# EasyEDA Pro project EasyEDAProPrj_Hackpad_numeric_keypad.epro

# Schematic Schematic1
Board Name: Board1; Create Date: 2026-03-23; Page Name: P1; Project Name: HackPad; Schematic Name: Schematic1; Update Date: 2026-03-23; Company: YuanRetro; Page Size: A4; Version: V4.0
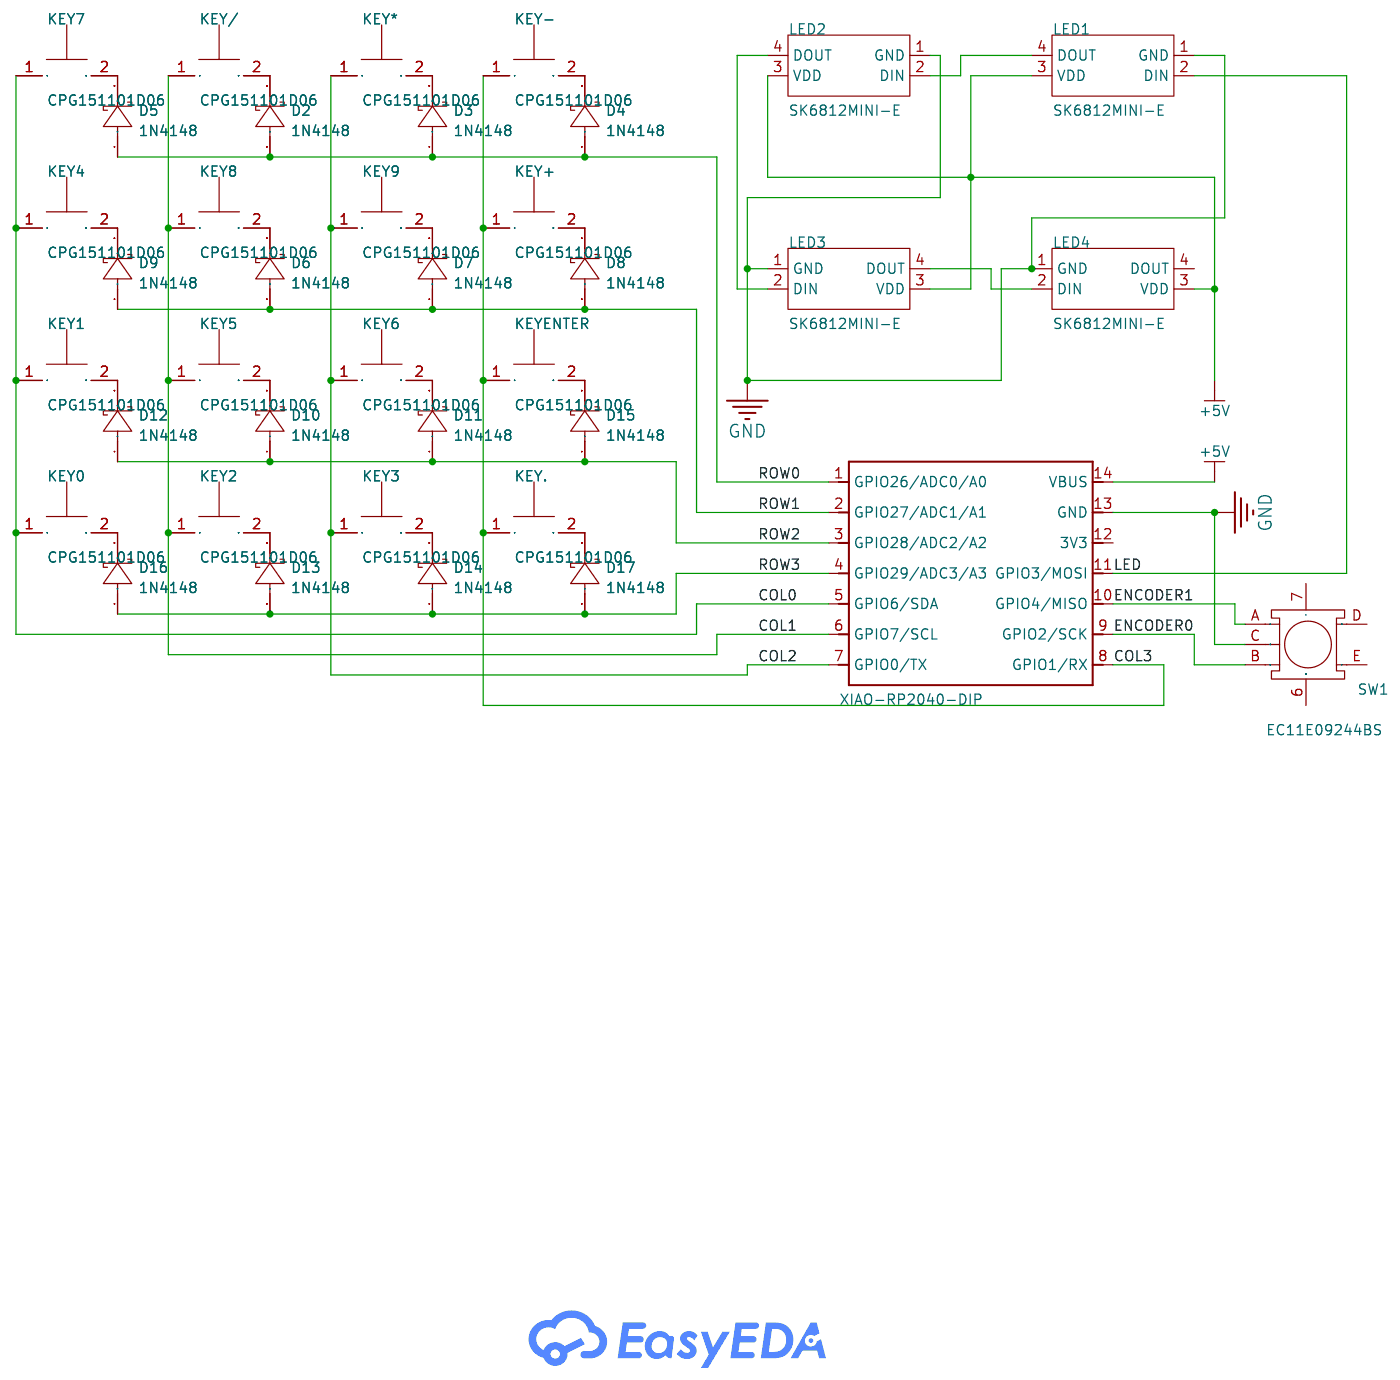
[diagram p0: schematic sheet]

## Parts
D2  1N4148  [DO-35_BD2.2-L4.0-D0.50_1N4148]
D3  1N4148  [DO-35_BD2.2-L4.0-D0.50_1N4148]
D4  1N4148  [DO-35_BD2.2-L4.0-D0.50_1N4148]
D5  1N4148  [DO-35_BD2.2-L4.0-D0.50_1N4148]
D6  1N4148  [DO-35_BD2.2-L4.0-D0.50_1N4148]
D7  1N4148  [DO-35_BD2.2-L4.0-D0.50_1N4148]
D8  1N4148  [DO-35_BD2.2-L4.0-D0.50_1N4148]
D9  1N4148  [DO-35_BD2.2-L4.0-D0.50_1N4148]
D10  1N4148  [DO-35_BD2.2-L4.0-D0.50_1N4148]
D11  1N4148  [DO-35_BD2.2-L4.0-D0.50_1N4148]
D12  1N4148  [DO-35_BD2.2-L4.0-D0.50_1N4148]
D13  1N4148  [DO-35_BD2.2-L4.0-D0.50_1N4148]
D14  1N4148  [DO-35_BD2.2-L4.0-D0.50_1N4148]
D15  1N4148  [DO-35_BD2.2-L4.0-D0.50_1N4148]
D16  1N4148  [DO-35_BD2.2-L4.0-D0.50_1N4148]
D17  1N4148  [DO-35_BD2.2-L4.0-D0.50_1N4148]
KEY0  CPG151101D06  [KEY-TH_CPG151101D06]
KEY1  CPG151101D06  [KEY-TH_CPG151101D06]
KEY2  CPG151101D06  [KEY-TH_CPG151101D06]
KEY3  CPG151101D06  [KEY-TH_CPG151101D06]
KEY4  CPG151101D06  [KEY-TH_CPG151101D06]
KEY5  CPG151101D06  [KEY-TH_CPG151101D06]
KEY6  CPG151101D06  [KEY-TH_CPG151101D06]
KEY7  CPG151101D06  [KEY-TH_CPG151101D06]
KEY8  CPG151101D06  [KEY-TH_CPG151101D06]
KEY9  CPG151101D06  [KEY-TH_CPG151101D06]
KEY*  CPG151101D06  [KEY-TH_CPG151101D06]
KEY+  CPG151101D06  [KEY-TH_CPG151101D06]
KEY-  CPG151101D06  [KEY-TH_CPG151101D06]
KEY.  CPG151101D06  [KEY-TH_CPG151101D06]
KEY/  CPG151101D06  [KEY-TH_CPG151101D06]
KEYENTER  CPG151101D06  [KEY-TH_CPG151101D06]
LED1  SK6812MINI-E  [LED-SMD_4P-L3.2-W2.8-LS5.9_SK6812MINI-E]
LED2  SK6812MINI-E  [LED-SMD_4P-L3.2-W2.8-LS5.9_SK6812MINI-E]
LED3  SK6812MINI-E  [LED-SMD_4P-L3.2-W2.8-LS5.9_SK6812MINI-E]
LED4  SK6812MINI-E  [LED-SMD_4P-L3.2-W2.8-LS5.9_SK6812MINI-E]
SW1  EC11E09244BS  [SW-TH_EC11XXXXXXXX]
U1  XIAO-RP2040-DIP  [XIAO-RP2040-DIP]

## Library data of the parts
D2-D17 = 1N4148_C18195411: Voltage - Forward(Vf@If):1V@10mA Voltage - DC Reverse(Vr):100V Current - Rectified:150mA Pd - Power Dissipation:500mW Reverse Leakage Current (Ir):5mA Reverse Recovery Time (trr):4ns Operating Junction Temperature Range:-60℃~+200℃ Operating Junction Tempe; LCSC Part Name: 100V 150mA; Supplier Part: C18195411; Manufacturer: LJ(朗捷); Supplier Footprint: DO-35; JLCPCB Part Class: Extended Part; Datasheet: https://item.szlcsc.com/datasheet/1N4148/19344798.html; Supplier: LCSC; Voltage - Forward(Vf@If): 1V@10mA; Voltage - DC Reverse(Vr): 100V; Current - Rectified: 150mA; Pd - Power Dissipation: 500mW; Reverse Leakage Current (Ir): 5mA; Reverse Recovery Time (trr): 4ns; Operating Junction Temperature Range: -60℃~+200℃; Non-Repetitive Peak Forward Surge Current: 500mA
KEY0-KEY9 KEY* KEY+ KEY- KEY. KEY/ KEYENTER = CPG151101D06: Supplier Part: C49234237; Manufacturer: HanElectricity(瀚源); Supplier Footprint: 插件; JLCPCB Part Class: Extended Part; Datasheet: https://item.szlcsc.com/datasheet/CPG151101D06/51650379.html; Supplier: LCSC
LED1-LED4 = SK6812MINI-E_C5149201: Supplier Part: C5149201; Manufacturer: 欧思科光电; Supplier Footprint: SMD; JLCPCB Part Class: Extended Part; Datasheet: https://item.szlcsc.com/datasheet/SK6812MINI-E/5773397.html; Supplier: LCSC
SW1 = EC11E09244BS: LCSC Part Name: 11型金属轴型编码器; Supplier Part: C470742; Manufacturer: ALPSALPINE(阿尔卑斯阿尔派); Supplier Footprint: 插件; JLCPCB Part Class: Extended Part; Datasheet: https://item.szlcsc.com/datasheet/EC11E09244BS/476822.html; Supplier: LCSC
U1 = XIAO-RP2040-DIP

## Nets
+5V: LED1.3(VDD) LED2.3(VDD) LED3.3(VDD) LED4.3(VDD) U1.14(VBUS)
GND: LED1.1(GND) LED2.1(GND) LED3.1(GND) LED4.1(GND) SW1.C U1.13(GND)
COL0: KEY0.1 KEY1.1 KEY4.1 KEY7.1 U1.5(GPIO6/SDA)
COL1: KEY2.1 KEY5.1 KEY8.1 KEY/.1 U1.6(GPIO7/SCL)
COL2: KEY3.1 KEY6.1 KEY9.1 KEY*.1 U1.7(GPIO0/TX)
COL3: KEY+.1 KEY-.1 KEY..1 KEYENTER.1 U1.8(GPIO1/RX)
ENCODER0: SW1.B U1.9(GPIO2/SCK)
ENCODER1: SW1.A U1.10(GPIO4/MISO)
LED: LED1.2(DIN) U1.11(GPIO3/MOSI)
ROW0: D2.1(A) D3.1(A) D4.1(A) D5.1(A) U1.1(GPIO26/ADC0/A0)
ROW1: D6.1(A) D7.1(A) D8.1(A) D9.1(A) U1.2(GPIO27/ADC1/A1)
ROW2: D10.1(A) D11.1(A) D12.1(A) D15.1(A) U1.3(GPIO28/ADC2/A2)
ROW3: D13.1(A) D14.1(A) D16.1(A) D17.1(A) U1.4(GPIO29/ADC3/A3)
$1N1250: D3.2(K) KEY*.2
$1N1291: D2.2(K) KEY/.2
$1N1373: D8.2(K) KEY+.2
$1N1414: D7.2(K) KEY9.2
$1N1455: D6.2(K) KEY8.2
$1N1496: D5.2(K) KEY7.2
$1N1537: D11.2(K) KEY6.2
$1N1578: D10.2(K) KEY5.2
$1N1619: D9.2(K) KEY4.2
$1N1660: D15.2(K) KEYENTER.2
$1N1701: D14.2(K) KEY3.2
$1N1742: D13.2(K) KEY2.2
$1N1783: D12.2(K) KEY1.2
$1N1865: D17.2(K) KEY..2
$1N1906: D16.2(K) KEY0.2
$1N10808: D4.2(K) KEY-.2
$1N11996: LED1.4(DOUT) LED2.2(DIN)
$1N12003: LED2.4(DOUT) LED3.2(DIN)
$1N12010: LED3.4(DOUT) LED4.2(DIN)

Not connected (* = marked no-connect by the designer): LED4 4(DOUT); SW1 6 7 D E; U1 12(3V3)

# Board PCB1
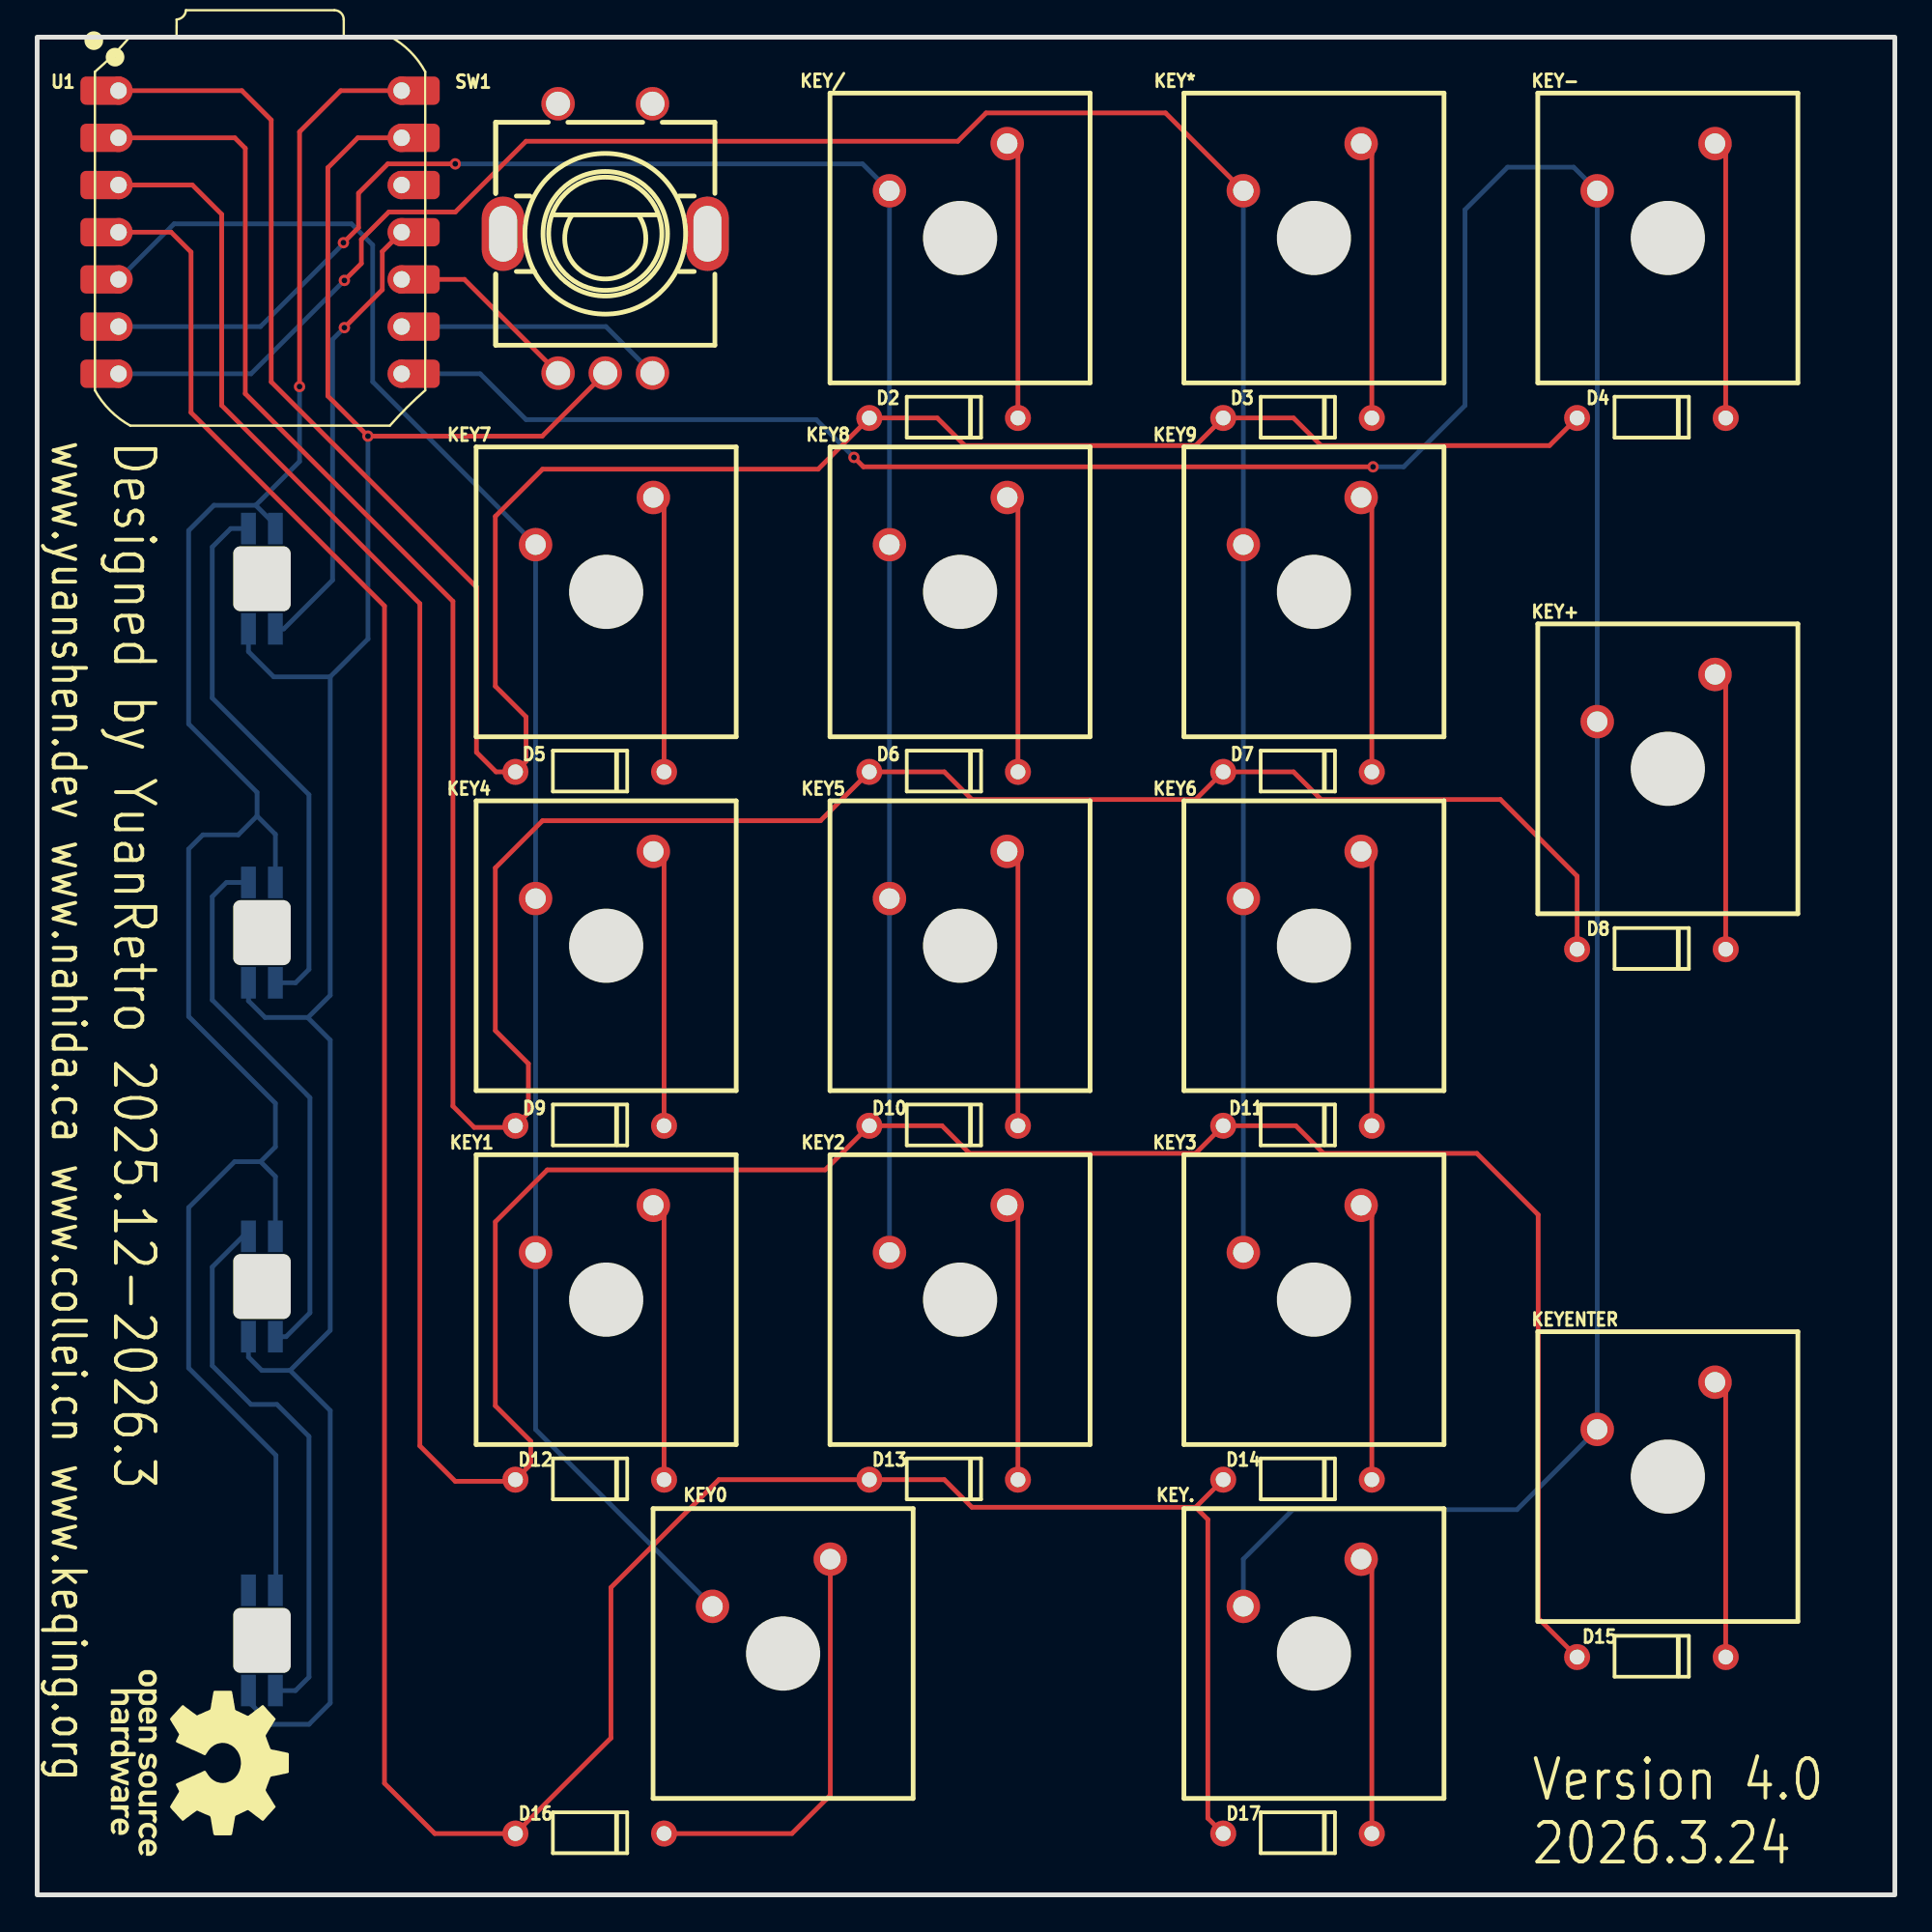
[diagram p1: board, top side]
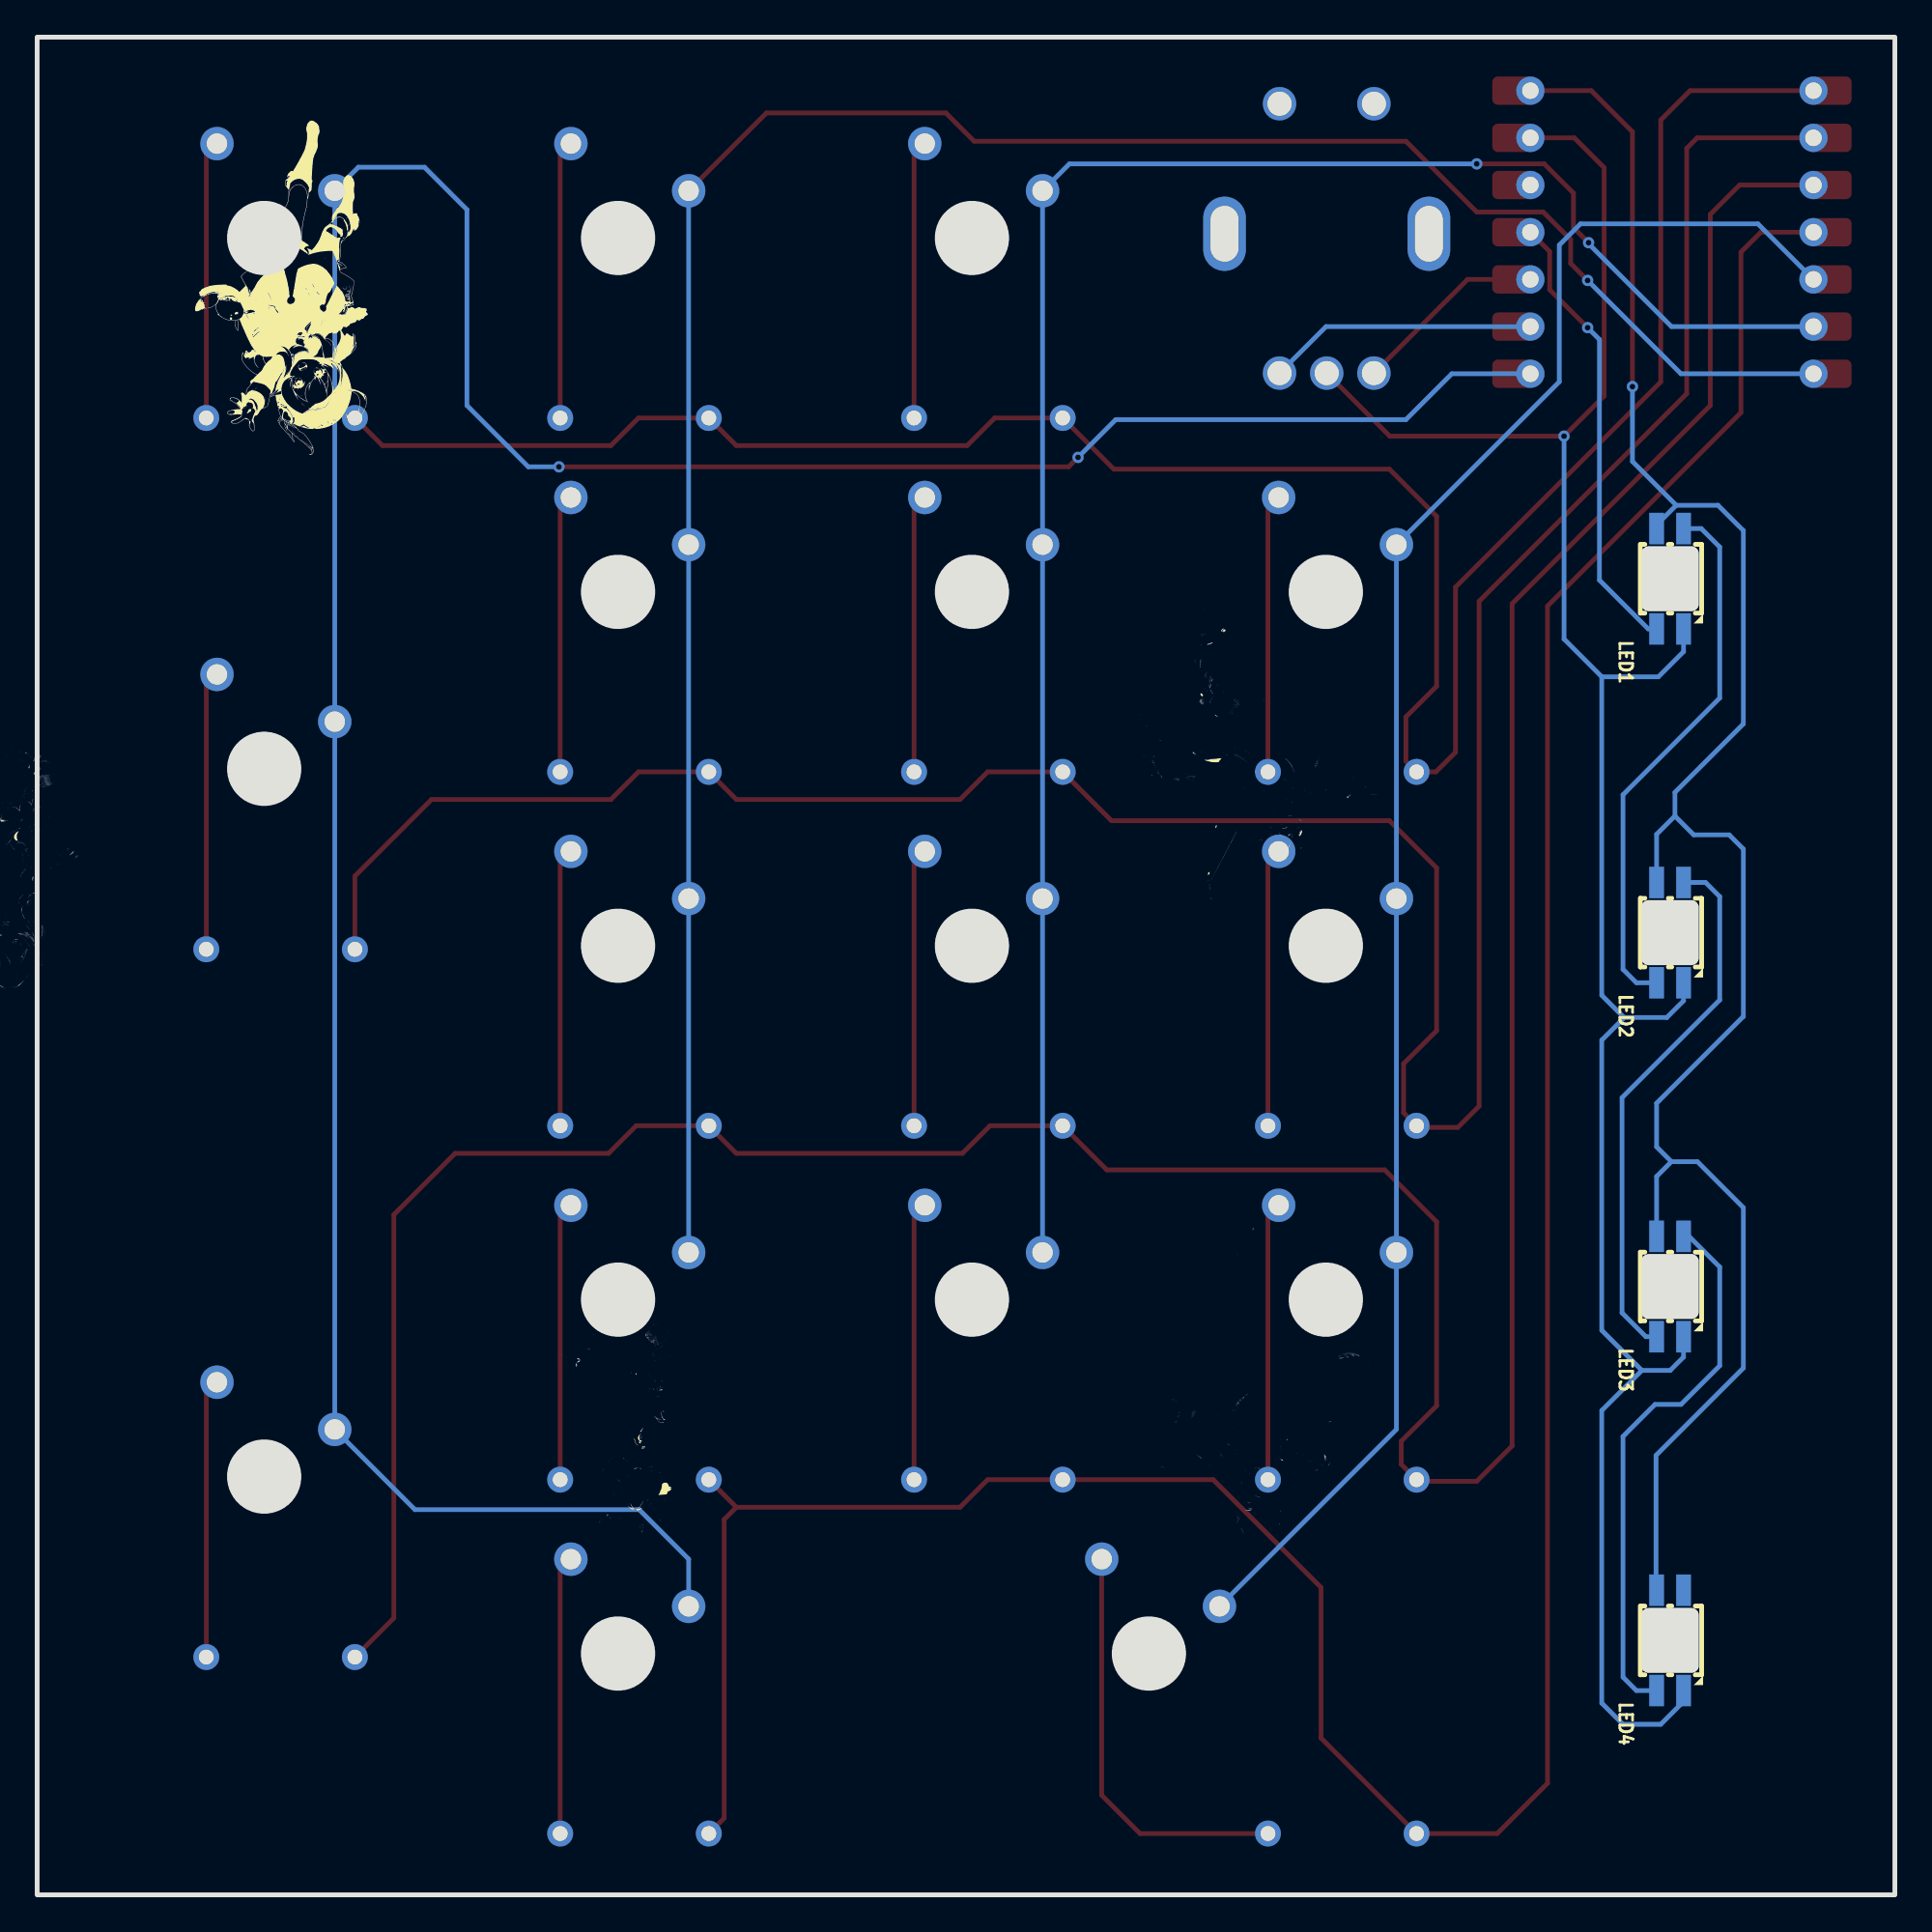
[diagram p2: board, bottom side, seen from below]

Outline 100 x 100 mm; copper layers: Top Layer, Bottom Layer. Coordinates in mm from the lower left corner of the outline.
Outline path: rectangle 0,100 100,0
Stack: Top Layer 0.035mm / Dielectric1 1.51mm FR4 er 4.5 / Bottom Layer 0.035mm

## Design rules (mm)
template: JLCPCB Capability(Two Layers Board)
spacing copperThickness1oz (default): track to track 0.102, other pairs 0.152 to 0.3
spacing copperThickness2oz: track to track 0.203, other pairs 0.152 to 0.3
track width copperThickness1oz (default): min 0.127, default 0.254, max 2.54
track width copperThickness2oz: min 0.203, default 0.254, max 2.54
differential pair differentialPair (default): width min 0.127, default 0.254, max 2.54; gap min 0.152, default 0.152
via viaSize (default): diameter min 0.5, default 0.61, max 10; hole min 0.3, default 0.305, max 6.3

## Placement (name value [footprint] x y rotation side)
D2  1N4148  [DO-35_BD2.2-L4.0-D0.50_1N4148]  48.8 79.5 0 top
D3  1N4148  [DO-35_BD2.2-L4.0-D0.50_1N4148]  67.85 79.5 0 top
D4  1N4148  [DO-35_BD2.2-L4.0-D0.50_1N4148]  86.9 79.5 0 top
D5  1N4148  [DO-35_BD2.2-L4.0-D0.50_1N4148]  29.75 60.45 0 top
D6  1N4148  [DO-35_BD2.2-L4.0-D0.50_1N4148]  48.8 60.45 0 top
D7  1N4148  [DO-35_BD2.2-L4.0-D0.50_1N4148]  67.85 60.45 0 top
D8  1N4148  [DO-35_BD2.2-L4.0-D0.50_1N4148]  86.9 50.9 0 top
D9  1N4148  [DO-35_BD2.2-L4.0-D0.50_1N4148]  29.75 41.4 0 top
D10  1N4148  [DO-35_BD2.2-L4.0-D0.50_1N4148]  48.8 41.4 0 top
D11  1N4148  [DO-35_BD2.2-L4.0-D0.50_1N4148]  67.85 41.4 0 top
D12  1N4148  [DO-35_BD2.2-L4.0-D0.50_1N4148]  29.75 22.35 0 top
D13  1N4148  [DO-35_BD2.2-L4.0-D0.50_1N4148]  48.8 22.35 0 top
D14  1N4148  [DO-35_BD2.2-L4.0-D0.50_1N4148]  67.85 22.35 0 top
D15  1N4148  [DO-35_BD2.2-L4.0-D0.50_1N4148]  86.9 12.8 0 top
D16  1N4148  [DO-35_BD2.2-L4.0-D0.50_1N4148]  29.75 3.3 0 top
D17  1N4148  [DO-35_BD2.2-L4.0-D0.50_1N4148]  67.85 3.3 0 top
KEY0  CPG151101D06  [KEY-TH_CPG151101D06]  39.53 16.8 0 top
KEY1  CPG151101D06  [KEY-TH_CPG151101D06]  30 35.85 0 top
KEY2  CPG151101D06  [KEY-TH_CPG151101D06]  49.05 35.85 0 top
KEY3  CPG151101D06  [KEY-TH_CPG151101D06]  68.1 35.85 0 top
KEY4  CPG151101D06  [KEY-TH_CPG151101D06]  30 54.9 0 top
KEY5  CPG151101D06  [KEY-TH_CPG151101D06]  49.05 54.9 0 top
KEY6  CPG151101D06  [KEY-TH_CPG151101D06]  68.1 54.9 0 top
KEY7  CPG151101D06  [KEY-TH_CPG151101D06]  30 73.95 0 top
KEY8  CPG151101D06  [KEY-TH_CPG151101D06]  49.05 73.95 0 top
KEY9  CPG151101D06  [KEY-TH_CPG151101D06]  68.1 73.95 0 top
KEY*  CPG151101D06  [KEY-TH_CPG151101D06]  68.1 93 0 top
KEY+  CPG151101D06  [KEY-TH_CPG151101D06]  87.15 64.42 0 top
KEY-  CPG151101D06  [KEY-TH_CPG151101D06]  87.15 93 0 top
KEY.  CPG151101D06  [KEY-TH_CPG151101D06]  68.1 16.8 0 top
KEY/  CPG151101D06  [KEY-TH_CPG151101D06]  49.05 93 0 top
KEYENTER  CPG151101D06  [KEY-TH_CPG151101D06]  87.15 26.33 0 top
LED1  SK6812MINI-E  [LED-SMD_4P-L3.2-W2.8-LS5.9_SK6812MINI-E]  12.1 70.85 90 bottom
LED2  SK6812MINI-E  [LED-SMD_4P-L3.2-W2.8-LS5.9_SK6812MINI-E]  12.1 51.8 90 bottom
LED3  SK6812MINI-E  [LED-SMD_4P-L3.2-W2.8-LS5.9_SK6812MINI-E]  12.1 32.75 90 bottom
LED4  SK6812MINI-E  [LED-SMD_4P-L3.2-W2.8-LS5.9_SK6812MINI-E]  12.1 13.7 90 bottom
SW1  EC11E09244BS  [SW-TH_EC11XXXXXXXX]  30.58 89.17 0 top
U1  -  [XIAO-RP2040-DIP]  12 89.5 0 top

## Footprints (pads in the part's own frame, mm; a bottom-side part is the same pattern mirrored in y, then rotated)
DO-35_BD2.2-L4.0-D0.50_1N4148
  round 1.4 hole 0.8: 1(-4,0) 2(4,0)
KEY-TH_CPG151101D06
  round 1.8 hole 1.1: 1(-3.17,-1.27) 2(3.17,1.27)
LED-SMD_4P-L3.2-W2.8-LS5.9_SK6812MINI-E
  rect 1.7x0.8 smd: 1(-2.7,-0.725) 2(-2.7,0.725) 3(2.7,0.725) 4(2.7,-0.725)
SW-TH_EC11XXXXXXXX
  oval 2.3x4 hole 1.5x3: 6(5.5,0.25) 7(-5.5,0.25)
  round 1.8 hole 1.3: A(-2.54,-7.25) B(2.54,-7.25) C(0,-7.25) D(-2.54,7.25) E(2.54,7.25)
XIAO-RP2040-DIP
  rrect 2.432x1.524 smd: 1(-8.455,7.62) 2(-8.455,5.08) 3(-8.455,2.54) 4(-8.455,0) 5(-8.455,-2.54) 6(-8.455,-5.08) 7(-8.455,-7.62) 8(8.455,-7.62) 9(8.455,-5.08) 10(8.455,-2.54) 11(8.455,0) 12(8.455,2.54) 13(8.455,5.08) 14(8.455,7.62)
  round 1.524 hole 0.889: 1(-7.62,7.62) 2(-7.62,5.08) 3(-7.62,2.54) 4(-7.62,0) 5(-7.62,-2.54) 6(-7.62,-5.08) 7(-7.62,-7.62) 8(7.62,-7.62) 9(7.62,-5.08) 10(7.62,-2.54) 11(7.62,0) 12(7.62,2.54) 13(7.62,5.08) 14(7.62,7.62)

## Nets
As in the schematic.

Pads without a net: LED4 4; SW1 6 7 D E; U1 12

## Via types
v1: diameter 0.61, hole 0.305, Top Layer to Bottom Layer, 8 vias

## Routing (per net, layer and track width the routed paths; a pad name or vN(x,y) marks a point on that pad's centre or on a via; arc(x,y) is an arc through that point)
+5V: length 109.6
  Top Layer w0.254: U1.14 16.34,97.12 14.12,94.91 v1(14.12,81.19)
  Bottom Layer w0.254: 12.03,39.47 10.63,39.47 8.16,36.99 8.16,28.36 12.86,23.66 12.86,16.43 LED4.3 ; 12.03,39.47 12.83,40.27 12.83,42.61 8.16,47.28 8.16,56.3 8.92,57.06 10.82,57.06 11.84,58.08 ; 12.03,39.47 12.83,38.67 LED3.3 ; LED1.3 12.97,73.7 ; LED2.3 12.83,57.09 11.84,58.08 ; 11.76,74.8 12.83,73.74 ; 11.76,74.8 14.12,77.16 v1(14.12,81.19) ; 11.76,74.8 9.52,74.8 8.16,73.44 8.16,63.03 11.84,59.34 11.84,58.08
GND: length 126.3
  Top Layer w0.254: U1.13 17.26,94.58 15.65,92.97 15.65,80.68 v1(17.81,78.52) 27.19,78.52 SW1.C
  Bottom Layer w0.254: 13.62,28.23 12.09,28.23 11.38,28.95 LED3.1 ; 13.62,28.23 15.78,26.07 15.78,10.32 14.63,9.18 12.6,9.18 11.46,10.32 11.46,10.91 LED4.1 ; 13.62,28.23 15.78,30.39 15.78,46.01 14.58,47.21 14.58,47.23 ; 15.78,65.57 15.78,48.42 14.58,47.23 ; 15.78,65.57 12.73,65.57 11.38,66.92 LED1.1 ; 15.78,65.57 17.81,67.6 v1(17.81,78.52) ; 14.58,47.23 12.27,47.23 11.38,48.12 LED2.1
(no net): length 0.1
  Top Layer w0.254: U1.12 19.56,91.98
COL0: length 96.3
  Bottom Layer w0.254: KEY0.1 26.83,25.06 KEY1.1 KEY4.1 KEY7.1 18.06,81.45 18.06,88.81 16.92,89.95 7.37,89.95 U1.5
COL1: length 104
  Top Layer w0.254: v1(22.51,93.18) 18.88,93.18 17.3,91.6 17.3,89.75 v1(16.49,88.94)
  Bottom Layer w0.254: v1(16.49,88.94) 16.41,88.86 16.41,88.81 12.02,84.42 U1.6 ; KEY2.1 KEY5.1 KEY8.1 KEY/.1 44.43,93.18 v1(22.51,93.18)
COL2: length 126
  Top Layer w0.254: v1(16.54,86.9) 17.45,87.82 17.45,89.11 18.93,90.59 22.51,90.59 26.32,94.4 49.56,94.4 51.08,95.92 60.74,95.92 KEY*.1
  Bottom Layer w0.254: KEY*.1 KEY9.1 KEY6.1 KEY3.1 ; v1(16.54,86.9) 11.51,81.88 U1.7
COL3: length 171
  Top Layer w0.254: v1(43.97,77.38) 44.48,76.87 v1(71.91,76.87)
  Bottom Layer w0.254: v1(71.91,76.87) 73.56,76.87 76.86,80.17 76.86,90.71 79.15,93 82.71,93 KEY-.1 KEY+.1 KEYENTER.1 79.66,20.74 67.59,20.74 64.93,18.07 KEY..1 ; U1.8 23.85,81.88 26.32,79.41 41.94,79.41 v1(43.97,77.38)
ENCODER0: length 14.5
  Bottom Layer w0.254: U1.9 30.62,84.42 SW1.B
ENCODER1: length 9.7
  Top Layer w0.254: SW1.A 23,86.96 U1.10
LED: length 24.4
  Top Layer w0.254: v1(16.54,84.36) 18.58,86.41 18.58,88.46 U1.11
  Bottom Layer w0.254: v1(16.54,84.36) 15.9,83.73 15.9,70.78 13.27,68.15 LED1.2
ROW0: length 127.6
  Top Layer w0.254: U1.1 11.02,97.12 12.6,95.54 12.6,81.44 23.65,70.39 23.65,61.5 24.7,60.45 D5.1 26.32,61.02 26.32,63.41 24.67,65.06 24.67,74.2 27.21,76.74 42.04,76.74 D2.1 48.45,79.5 49.94,78.01 62.36,78.01 D3.1 67.63,79.5 69.12,78.01 81.41,78.01 D4.1
ROW1: length 149.9
  Top Layer w0.254: U1.2 10.64,94.58 11.2,94.02 11.2,80.81 22.38,69.63 22.38,42.45 23.52,41.31 25.66,41.31 D9.1 26.44,42.1 26.44,44.74 24.67,46.52 24.67,55.28 27.21,57.82 42.17,57.82 D6.1 48.83,60.45 50.32,58.96 62.36,58.96 D7.1 67.63,60.45 69.12,58.96 78.77,58.96 82.9,54.84 D8.1
ROW2: length 184.2
  Top Layer w0.254: D15.1 80.8,14.9 80.8,36.61 77.5,39.91 69.24,39.91 67.76,41.4 D11.1 62.36,39.91 50.19,39.91 48.71,41.4 D10.1 42.42,39.03 27.46,39.03 24.67,36.23 24.67,26.33 26.57,24.42 26.57,23.18 D12.1 25.66,22.26 22.51,22.26 20.6,24.17 20.6,69.5 9.93,80.17 9.93,90.46 8.35,92.04 U1.3 ; 83.21,12.86 83.15,12.8
ROW3: length 169.4
  Top Layer w0.254: 62.36,20.86 63.02,20.2 63.02,4.13 D17.1 ; 62.36,20.86 50.32,20.86 48.83,22.35 D13.1 36.69,22.35 30.89,16.55 30.89,8.44 D16.1 21.4,3.3 18.7,6 18.7,69.38 8.28,79.79 8.28,88.43 7.21,89.5 U1.4 ; 62.36,20.86 D14.1
$1N1250: length 15
  Top Layer w0.254: D3.2 71.85,93.69 KEY*.2
$1N1291: length 15
  Top Layer w0.254: D2.2 52.8,93.69 KEY/.2
$1N1373: length 15
  Top Layer w0.254: KEY+.2 90.9,65.12 D8.2
$1N1414: length 15
  Top Layer w0.254: KEY9.2 71.85,74.64 D7.2
$1N1455: length 15
  Top Layer w0.254: KEY8.2 52.8,74.64 D6.2
$1N1496: length 15
  Top Layer w0.254: D5.2 33.75,74.64 KEY7.2
$1N1537: length 15
  Top Layer w0.254: D11.2 71.85,55.59 KEY6.2
$1N1578: length 15
  Top Layer w0.254: KEY5.2 52.8,55.59 D10.2
$1N1619: length 15
  Top Layer w0.254: D9.2 33.75,55.59 KEY4.2
$1N1660: length 15
  Top Layer w0.254: D15.2 90.9,27.02 KEYENTER.2
$1N1701: length 15
  Top Layer w0.254: KEY3.2 71.85,36.54 D14.2
$1N1742: length 15
  Top Layer w0.254: KEY2.2 52.8,36.54 D13.2
$1N1783: length 15
  Top Layer w0.254: D12.2 33.75,36.54 KEY1.2
$1N1865: length 15
  Top Layer w0.254: KEY..2 71.85,17.49 D17.2
$1N1906: length 22.5
  Top Layer w0.254: KEY0.2 42.69,5.37 40.63,3.3 D16.2
$1N10808: length 15
  Top Layer w0.254: KEY-.2 90.9,93.69 D4.2
$1N11996: length 29.4
  Bottom Layer w0.254: LED2.2 13.91,49.1 14.63,49.82 14.63,59.22 9.43,64.42 9.43,72.55 10.42,73.55 LED1.4
$1N12003: length 29.2
  Bottom Layer w0.254: LED3.2 13.4,30.05 14.69,31.33 14.69,42.91 9.43,48.17 9.43,53.73 10.19,54.5 LED2.4
$1N12010: length 29.8
  Bottom Layer w0.254: LED3.4 11.08,35.45 9.43,33.8 9.43,28.48 11.51,26.4 12.91,26.4 14.63,24.67 14.63,11.72 13.91,11 LED4.2

## Text on the board
Top Silkscreen Layer: www.yuanshen.dev www.nahida.ca www.collei.cn www.keqing.org | Designed by YuanRetro 2025.12-2026.3 | Version 4.0 / 2026.3.24
